# EAGLE design atmega328_v1 (EAGLE 9.3.0)
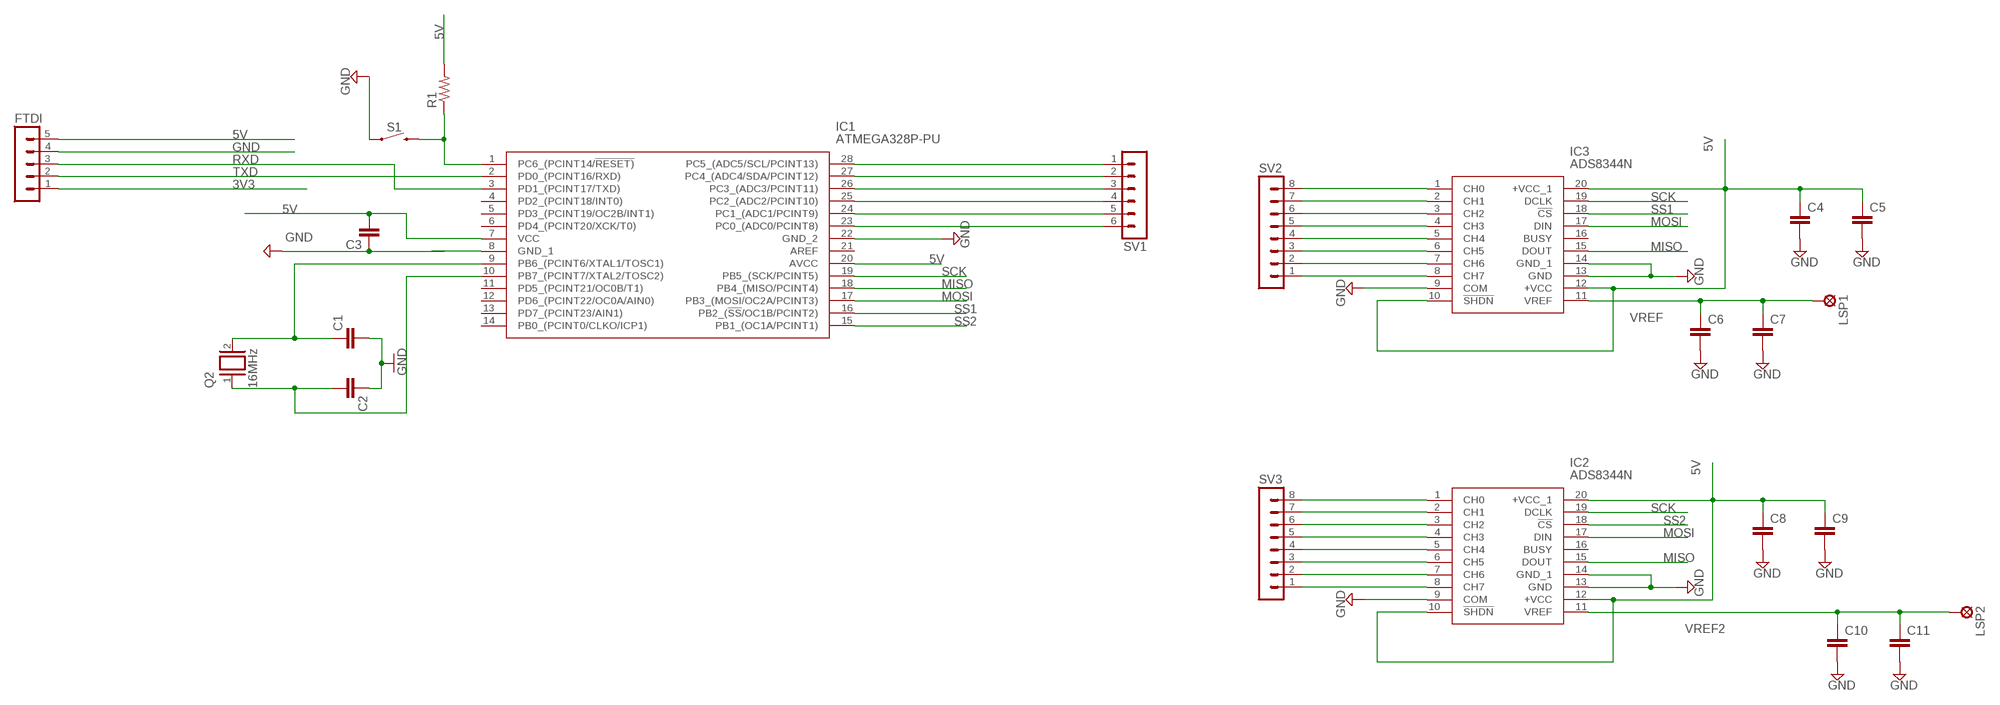
[diagram p0: schematic, sheet 1]

## Parts
C1  C-EU025-050X050  [C025-050X050]
C2  C-EU025-050X050  [C025-050X050]
C3  C-EU025-050X050  [C025-050X050]
C4  C-EU050-055X075  [C050-055X075]
C5  C-EU050-055X075  [C050-055X075]
C6  C-EU050-055X075  [C050-055X075]
C7  C-EU050-055X075  [C050-055X075]
C8  C-EU050-055X075  [C050-055X075]
C9  C-EU050-055X075  [C050-055X075]
C10  C-EU050-055X075  [C050-055X075]
C11  C-EU050-055X075  [C050-055X075]
FTDI  MA05-1  [MA05-1]
IC1  ATMEGA328P-PU  [DIP794W53P254L3467H457Q28N]
IC2  ADS8344N  [SOP65P780X200-20N]
IC3  ADS8344N  [SOP65P780X200-20N]
LSP1  SE11  [SE11]
LSP2  SE11  [SE11]
Q2  16MHz  XTAL/S  [QS]
R1  R-US_0309/12  [0309/12]
S1  MOMENTARY-SWITCH-SPST-SMD-5.2-REDUNDANT  [TACTILE_SWITCH_SMD_5.2MM]
SV1  MA06-1  [MA06-1]
SV2  MA08-1  [MA08-1]
SV3  MA08-1  [MA08-1]

## Nets
3V3: FTDI.1
5V: C3.2 C4.1 C5.1 C8.1 C9.1 FTDI.5 IC1.7(VCC) IC1.20(AVCC) IC2.10(!SHDN) IC2.12(+VCC) IC2.20(+VCC_1) IC3.10(!SHDN) IC3.12(+VCC) IC3.20(+VCC_1) R1.2
GND: C1.2 C2.1 C3.1 C4.2 C5.2 C6.2 C7.2 C8.2 C9.2 C10.2 C11.2 FTDI.4 IC1.22(GND_2) IC2.9(COM) IC2.13(GND) IC2.14(GND_1) IC3.9(COM) IC3.13(GND) IC3.14(GND_1) S1.1 S1.2
MISO: IC1.18(PB4_(MISO/PCINT4)) IC2.15(DOUT) IC3.15(DOUT)
MOSI: IC1.17(PB3_(MOSI/OC2A/PCINT3)) IC2.17(DIN) IC3.17(DIN)
N$1: IC3.1(CH0) SV2.8
N$2: IC1.8(GND_1)
N$3: IC1.28(PC5_(ADC5/SCL/PCINT13)) SV1.1
N$4: IC1.27(PC4_(ADC4/SDA/PCINT12)) SV1.2
N$5: C1.1 IC1.9(PB6_(PCINT6/XTAL1/TOSC1)) Q2.2
N$6: C2.2 IC1.10(PB7_(PCINT7/XTAL2/TOSC2)) Q2.1
N$7: IC1.26(PC3_(ADC3/PCINT11)) SV1.3
N$8: IC1.25(PC2_(ADC2/PCINT10)) SV1.4
N$9: IC1.24(PC1_(ADC1/PCINT9)) SV1.5
N$10: IC1.23(PC0_(ADC0/PCINT8)) SV1.6
N$11: IC1.1(PC6_(PCINT14/!RESET)) R1.1 S1.3 S1.4
N$12: IC3.2(CH1) SV2.7
N$13: IC3.3(CH2) SV2.6
N$14: IC3.4(CH3) SV2.5
N$15: IC3.5(CH4) SV2.4
N$16: IC3.6(CH5) SV2.3
N$17: IC3.7(CH6) SV2.2
N$18: IC3.8(CH7) SV2.1
N$22: IC2.1(CH0) SV3.8
N$23: IC2.2(CH1) SV3.7
N$24: IC2.3(CH2) SV3.6
N$25: IC2.4(CH3) SV3.5
N$26: IC2.5(CH4) SV3.4
N$27: IC2.6(CH5) SV3.3
N$28: IC2.7(CH6) SV3.2
N$29: IC2.8(CH7) SV3.1
RXD: FTDI.3 IC1.3(PD1_(PCINT17/TXD))
SCK: IC1.19(PB5_(SCK/PCINT5)) IC2.19(DCLK) IC3.19(DCLK)
SS1: IC1.16(PB2_(!SS!/OC1B/PCINT2)) IC3.18(!CS)
SS2: IC1.15(PB1_(OC1A/PCINT1)) IC2.18(!CS)
TXD: FTDI.2 IC1.2(PD0_(PCINT16/RXD))
VREF: C6.1 C7.1 IC3.11(VREF) LSP1.MP
VREF2: C10.1 C11.1 IC2.11(VREF) LSP2.MP
Unconnected: IC1.4(PD2_(PCINT18/INT0)) IC1.5(PD3_(PCINT19/OC2B/INT1)) IC1.6(PD4_(PCINT20/XCK/T0)) IC1.11(PD5_(PCINT21/OC0B/T1)) IC1.12(PD6_(PCINT22/OC0A/AIN0)) IC1.13(PD7_(PCINT23/AIN1)) IC1.14(PB0_(PCINT0/CLKO/ICP1)) IC1.21(AREF) IC2.16(BUSY) IC3.16(BUSY)

## Library data of the parts
C1-C11 = rcl:C-EU: CAPACITOR, European symbol; SPICEPREFIX: C
FTDI = con-lstb:MA05-1: PIN HEADER; OC_FARNELL: unknown; OC_NEWARK: unknown
IC1 = SamacSys_Parts:ATMEGA328P-PU: MICROCHIP - ATMEGA328P-PU. - MICROCONTROLLER MCU, 8 BIT, ATMEGA, 20MHZ, DIP-28 Source: Datasheet <https://componentsearchengine.com/Datasheets/1/ATMEGA328P-PU.pdf>; DESCRIPTION: MICROCHIP - ATMEGA328P-PU. - MICROCONTROLLER MCU, 8 BIT, ATMEGA, 20MHZ, DIP-28; HEIGHT: 4.572mm; MANUFACTURER_NAME: Microchip; MANUFACTURER_PART_NUMBER: ATMEGA328P-PU; MOUSER_PART_NUMBER: 556-ATMEGA328P-PU; MOUSER_PRICE-STOCK: https://www.mouser.com/Search/Refine.aspx?Keyword=556-ATMEGA328P-PU
IC2 IC3 = ADS8344N:ADS8344N: ADS8344N, 16-Bit Analogue to Digital Converter, Differential, Serial, 20-Pin SSOP Source: Datasheet <http://www.ti.com/lit/ds/symlink/ads8344.pdf>; DESCRIPTION: ADS8344N, 16-Bit Analogue to Digital Converter, Differential, Serial, 20-Pin SSOP; HEIGHT: 2mm; MANUFACTURER_NAME: Texas Instruments; MANUFACTURER_PART_NUMBER: ADS8344N; MOUSER_PART_NUMBER: 595-ADS8344N; MOUSER_PRICE-STOCK: https://www.mouser.com/Search/Refine.aspx?Keyword=595-ADS8344N
LSP1 LSP2 = solpad:SE11: SOLDER PAD RTM, drill 1,1mm, distributor Buerklin, 07F810
Q2 = special:XTAL/S: CRYSTAL
R1 = rcl:R-US_: RESISTOR, American symbol; SPICEPREFIX: R
S1 = SparkFun-Switches:MOMENTARY-SWITCH-SPST: Momentary Switch (Pushbutton) - SPST Normally-open (NO) SPST momentary switches (buttons, pushbuttons). Variants PTH-12MM - 12mm square, through-hole Momentary Pushbutton Switch - 12mm Square <https://www.sparkfun.com/products/9190> (COM-09190) PTH-6.0MM, PTH-6.0MM-KIT - 6.0mm square, through-hole Mini Pushbutton Switch <https://www.sparkfun.com/products/97> (COM-00097) KIT package intended for soldering kit's - only one side of pads' copper is exposed. PTH-RIGHT-ANGLE-KIT - Right-angle, through-hole Right Angle Tactile Button <https://www.sparkfun.com/products/10791> - Used on SparkFun BigTime Watch Kit <https://www.sparkfun.com/products/11734> SMD-12MM - 12mm square, surface-mount Tactile Button - SMD (12mm) <https://www.sparkfun.com/products/12993> (COM-12993) Used on SparkFun PicoBoard <https://www.sparkfun.com/products/11888> SMD-4.5MM - 4.5mm Square Trackball Switch Used on SparkFun Blackberry Trackballer Breakout <https://www.sparkfun.com/products/13169> SMD-4.6MMX2.8MM - 4.60mm x 2.80mm, surface mount Used on SparkFun SAMD21 Mini Breakout <https://www.sparkfun.com/products/13664> SMD-5.2MM, SMD-5.2-REDUNDANT - 5.2mm square, surface-mount Mini Pushbutton Switch - SMD <https://www.sparkfun.com/products/8720> (COM-08720) Used on Arduino Pro Mini <https://www.sparkfun.com/products/11114> REDUNDANT package connects both switch circuits together SMD-6.0X3.5MM - 6.0 x 3.5mm, surface mount Momentary Reset Switch SMD <https://www.sparkfun.com/products/8229> (COM-08229) SMD-6.2MM-TALL - 6.2mm square, surface mount Tactile Button - SMD (6mm) <https://www.sparkfun.com/products/12992> Used on SparkFun Digital Sandbox <https://www.sparkfun.com/products/12651> SMD-RIGHT-ANGLE - Right-angle, surface mount Used on SparkFun Block for Intel® Edison - Arduino <https://www.sparkfun.com/products/13036>; PROD_ID: SWCH-08247; SF_SKU: COM-08720
SV1 = con-lstb:MA06-1: PIN HEADER; OC_FARNELL: unknown; OC_NEWARK: unknown
SV2 SV3 = con-lstb:MA08-1: PIN HEADER; OC_FARNELL: unknown; OC_NEWARK: unknown

## Board
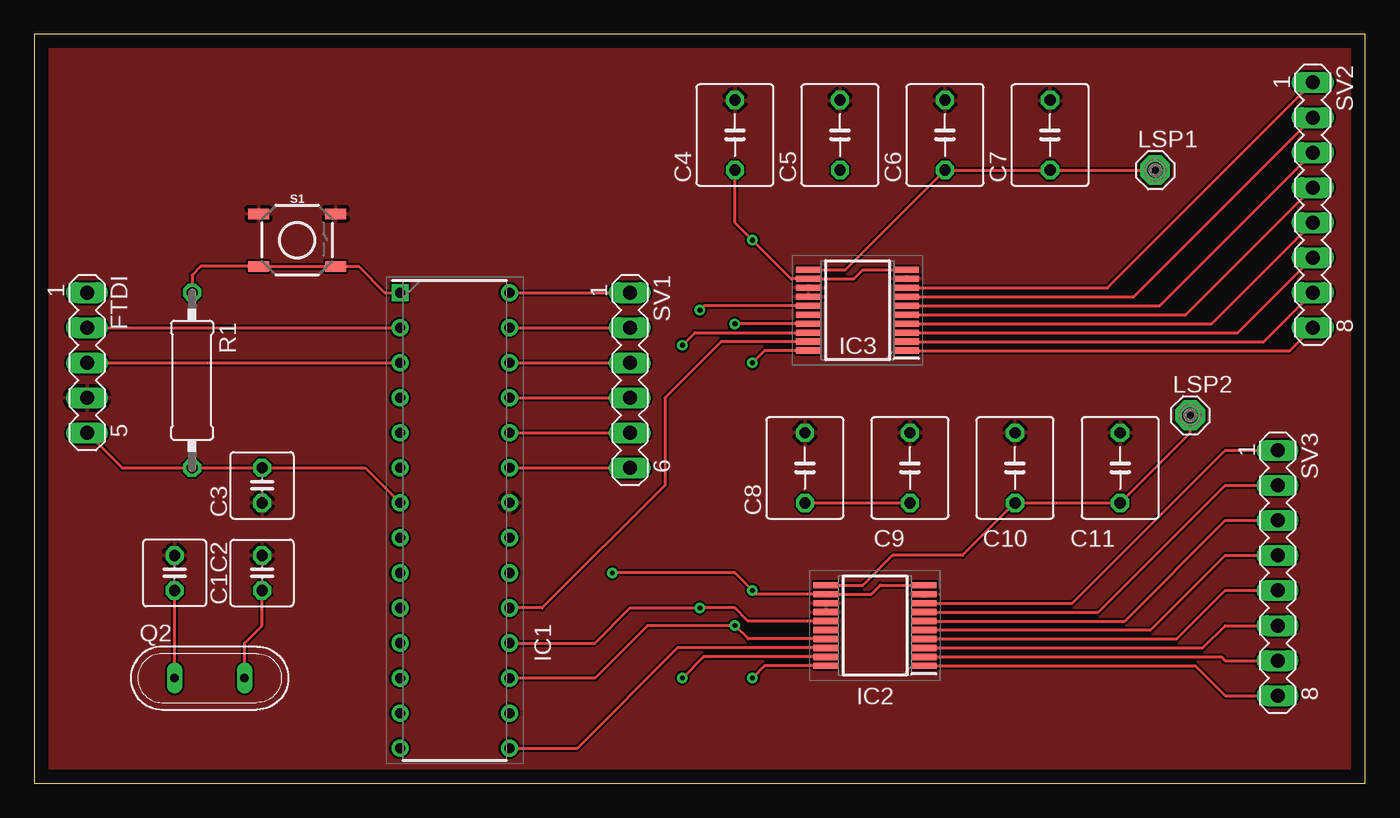
[diagram p1: board, top side]
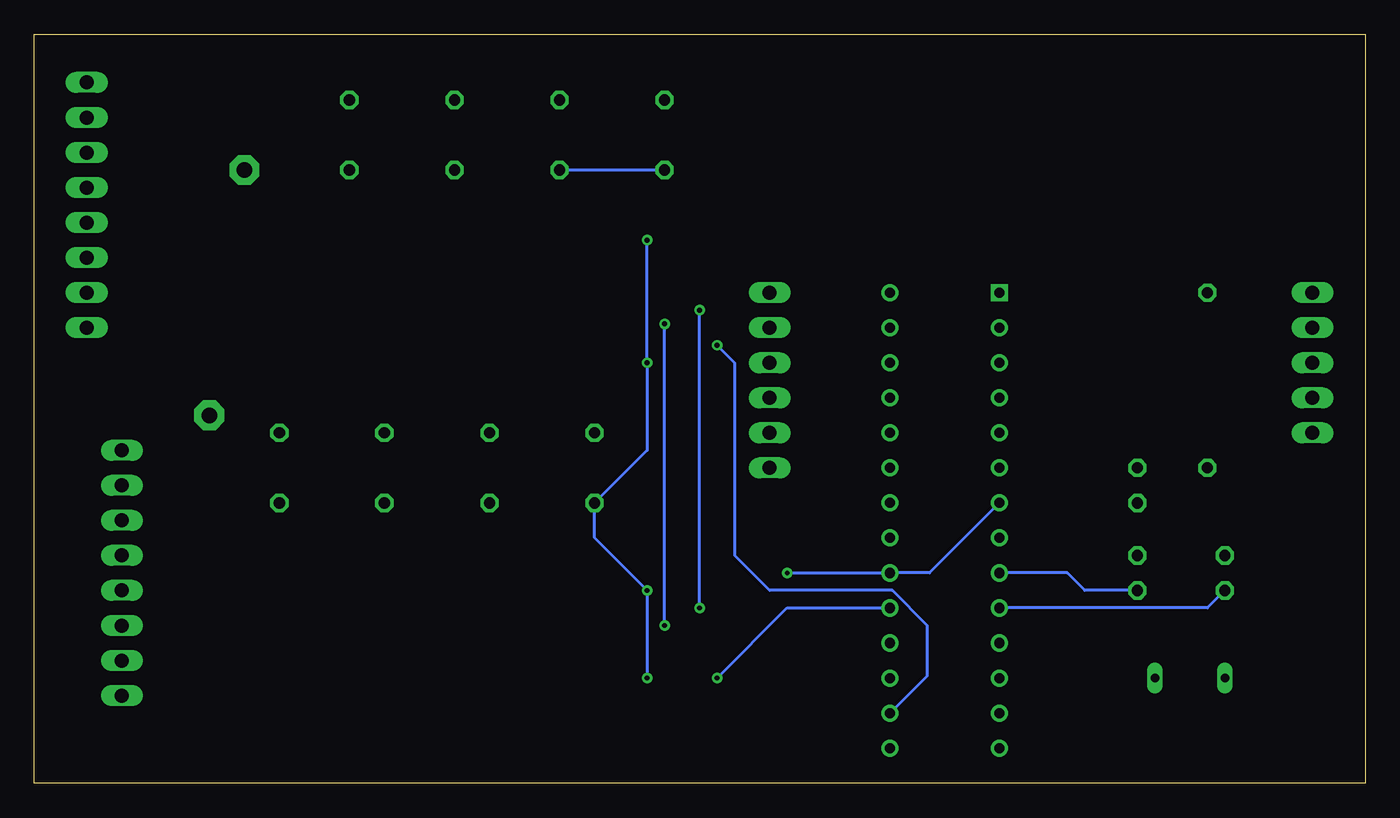
[diagram p2: board, bottom side, seen from below]

Size 96.5 x 54.28 mm. Coordinates in mm from the lower left corner, seen from the top.
Outline: 0,0 96.5,0 96.5,54.28 0,54.28 0,0
Copper layers (1*16): Top 0.035mm / dielectric 1.5mm / Bottom 0.035mm
Design rules "default": minimum track width 6mil, minimum drill 0.35mm, track to track 6mil, track to pad 6mil, pad to pad 6mil, via to via 6mil, smd to smd 6mil, copper to edge 40mil, drill to drill 6mil, minimum pad ring 10mil, minimum via ring 8mil, stop-mask expansion 4mil, vias tented up to drill 0mil, thermal gap 10mil

### Footprints (pad centres in the part's own frame; a part is rotated, then mirrored left to right if it is on the bottom)
C025-050X050 = drill 0.813 octagon: 1 -1.27,0; 2 1.27,0
C050-055X075 = drill 0.813 octagon: 1 -2.54,0; 2 2.54,0
MA05-1 = drill 1.016 long: 1 -5.08,0; 2 -2.54,0; 3 0,0; 4 2.54,0; 5 5.08,0
DIP794W53P254L3467H457Q28N = drill 0.733 pad 1.133 square: 1 -3.969,16.51 | drill 0.733 pad 1.133: 2 -3.969,13.97; 3 -3.969,11.43; 4 -3.969,8.89; 5 -3.969,6.35; 6 -3.969,3.81; 7 -3.969,1.27; 8 -3.969,-1.27; 9 -3.969,-3.81; 10 -3.969,-6.35; 11 -3.969,-8.89; 12 -3.969,-11.43; 13 -3.969,-13.97; 14 -3.969,-16.51; 15 3.969,-16.51; 16 3.969,-13.97; 17 3.969,-11.43; 18 3.969,-8.89; 19 3.969,-6.35; 20 3.969,-3.81; 21 3.969,-1.27; 22 3.969,1.27; 23 3.969,3.81; 24 3.969,6.35; 25 3.969,8.89; 26 3.969,11.43; 27 3.969,13.97; 28 3.969,16.51
SOP65P780X200-20N = smd 1.8 x 0.45: 1 -3.55,2.925; 2 -3.55,2.275; 3 -3.55,1.625; 4 -3.55,0.975; 5 -3.55,0.325; 6 -3.55,-0.325; 7 -3.55,-0.975; 8 -3.55,-1.625; 9 -3.55,-2.275; 10 -3.55,-2.925; 11 3.55,-2.925; 12 3.55,-2.275; 13 3.55,-1.625; 14 3.55,-0.975; 15 3.55,-0.325; 16 3.55,0.325; 17 3.55,0.975; 18 3.55,1.625; 19 3.55,2.275; 20 3.55,2.925
SE11 = drill 1.118 pad 2.159 octagon: MP 0,0
QS = drill 0.61 long: 1 -2.54,0; 2 2.54,0
0309/12 = drill 0.813 octagon: 1 -6.35,0; 2 6.35,0
TACTILE_SWITCH_SMD_5.2MM = smd 1.524 x 0.762: 1 -2.794,1.905; 2 2.794,1.905; 3 -2.794,-1.905; 4 2.794,-1.905
MA06-1 = drill 1.016 long: 1 -6.35,0; 2 -3.81,0; 3 -1.27,0; 4 1.27,0; 5 3.81,0; 6 6.35,0
MA08-1 = drill 1.016 long: 1 -8.89,0; 2 -6.35,0; 3 -3.81,0; 4 -1.27,0; 5 1.27,0; 6 3.81,0; 7 6.35,0; 8 8.89,0

### Placement (x,y rotation side)
C1  16.51,15.24 90 top
C2  10.16,15.24 270 top
C3  16.51,21.59 90 top
C4  50.8,46.99 90 top
C5  58.42,46.99 90 top
C6  66.04,46.99 90 top
C7  73.66,46.99 90 top
C8  55.88,22.86 90 top
C9  63.5,22.86 90 top
C10  71.12,22.86 90 top
C11  78.74,22.86 90 top
FTDI  3.81,30.48 270 top
IC1  30.48,19.05 0 top
IC2  60.96,11.43 180 top
IC3  59.69,34.29 180 top
LSP1  81.28,44.45 0 top
LSP2  83.82,26.67 0 top
Q2  12.7,7.62 0 top
R1  11.43,29.21 270 top
S1  19.05,39.37 0 top
SV1  43.18,29.21 270 top
SV2  92.71,41.91 270 top
SV3  90.17,15.24 270 top

### Tracks (layer width: path | path; a pad name or v marks a point on that pad's centre or on a via)
5V  (via drill 0.35)
  Top 0.203: FTDI.5 6.35,22.86 R1.2 C3.2 23.97,22.86 IC1.7 | IC3.10 60.08,37.22 59.42,36.56 IC3.12 54.88,36.56 v52.07,39.37 50.8,40.64 C4.1 | IC2.10 61.34,14.36 60.7,13.71 IC2.12 52.34,13.71 v52.07,13.97 50.8,15.24 v41.91,15.24 | C8.1 C9.1 | IC2.20 52.95,8.51 v52.07,7.62 | IC3.20 52.95,31.36 v52.07,30.48
  Bottom 0.203: IC1.7 31.59,15.24 IC1.20 v41.91,15.24 | v52.07,7.62 v52.07,13.97 55.88,17.78 C8.1 52.07,24.13 v52.07,30.48 v52.07,39.37 | C4.1 C5.1
GND
  pour Top: -7.62,-3.81 -7.62,78.74 109.22,77.47 109.22,-5.08 -6.35,-5.08
MISO  (via drill 0.35)
  Top 0.203: IC1.18 40.64,10.16 43.18,12.7 v48.26,12.7 50.8,12.7 51.74,11.76 IC2.15 | IC3.15 48.59,34.62 v48.26,34.29
  Bottom 0.203: v48.26,12.7 v48.26,34.29
MOSI  (via drill 0.35)
  Top 0.203: IC1.17 40.64,7.62 44.45,11.43 v50.8,11.43 51.77,10.46 IC2.17 | IC3.17 50.82,33.31 v50.8,33.3
  Bottom 0.203: v50.8,11.43 v50.8,33.3
N$1
  Top 0.203: IC3.1 91.06,31.36 SV2.8
N$3
  Top 0.203: IC1.28 SV1.1
N$4
  Top 0.203: IC1.27 SV1.2
N$5
  Top 0.203: Q2.2 15.24,10.16 16.51,11.43 C1.1
  Bottom 0.203: C1.1 20.32,13.97 21.59,15.24 IC1.9
N$6
  Top 0.203: Q2.1 C2.2
  Bottom 0.203: C2.2 11.43,12.7 IC1.10
N$7
  Top 0.203: IC1.26 SV1.3
N$8
  Top 0.203: IC1.25 SV1.4
N$9
  Top 0.203: IC1.24 SV1.5
N$10
  Top 0.203: IC1.23 SV1.6
N$11
  Top 0.203: R1.1 11.43,36.83 12.06,37.47 S1.3 S1.4 23.5,37.47 25.4,35.56 IC1.1
N$12
  Top 0.203: IC3.2 89.17,32.02 SV2.7
N$13
  Top 0.203: IC3.3 87.28,32.66 SV2.6
N$14
  Top 0.203: IC3.4 85.39,33.31 SV2.5
N$15
  Top 0.203: IC3.5 83.5,33.97 SV2.4
N$16
  Top 0.203: IC3.6 81.61,34.62 SV2.3
N$17
  Top 0.203: IC3.7 79.72,35.27 SV2.2
N$18
  Top 0.203: IC3.8 77.83,35.91 SV2.1
N$22
  Top 0.203: IC2.1 84.2,8.51 86.36,6.35 SV3.8
N$23
  Top 0.203: IC2.2 86.09,9.15 86.36,8.89 SV3.7
N$24
  Top 0.203: IC2.3 84.73,9.8 86.36,11.43 SV3.6
N$25
  Top 0.203: IC2.4 82.84,10.46 86.36,13.97 SV3.5
N$26
  Top 0.203: IC2.5 80.95,11.11 86.36,16.51 SV3.4
N$27
  Top 0.203: IC2.6 79.06,11.76 86.36,19.05 SV3.3
N$28
  Top 0.203: IC2.7 77.17,12.4 86.36,21.59 SV3.2
N$29
  Top 0.203: IC2.8 75.28,13.05 86.36,24.13 SV3.1
RXD
  Top 0.203: FTDI.3 IC1.3
SCK  (via drill 0.35)
  Top 0.203: IC2.19 48.52,9.15 v46.99,7.62 | IC1.19 36.83,12.7 45.72,21.59 45.72,27.94 49.8,32.02 IC3.19
  Bottom 0.203: v46.99,7.62 41.91,12.7 IC1.19
SS1  (via drill 0.35)
  Top 0.203: v46.99,31.75 47.91,32.66 IC3.18
  Bottom 0.203: IC1.16 31.75,7.78 31.75,11.43 34.29,13.97 43.18,13.97 45.72,16.51 45.72,30.48 v46.99,31.75
SS2
  Top 0.203: IC1.15 39.37,2.54 46.63,9.8 IC2.18
TXD
  Top 0.203: FTDI.2 IC1.2
VREF
  Top 0.203: IC3.11 58.8,37.22 C6.1 C7.1 LSP1.MP
VREF2
  Top 0.203: LSP2.MP 83.82,25.4 C11.1 C10.1 67.31,16.51 62.23,16.51 60.08,14.36 IC2.11